# Altium schematic sheet poweramp.SchDoc
size A4
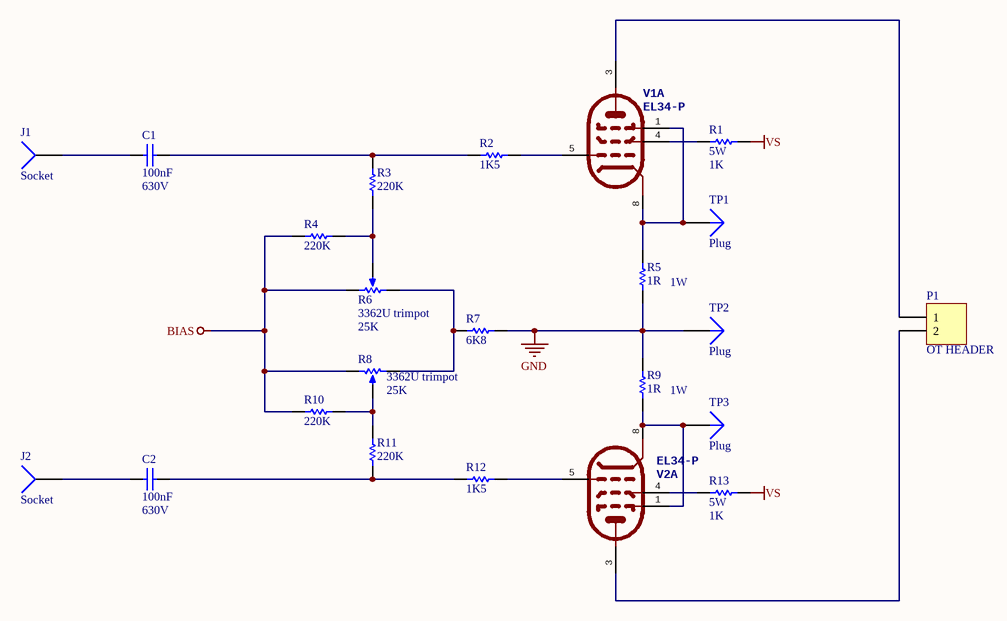
[diagram p0: poweramp.SchDoc]

## Parts
C1  value 100nF  Voltage: 630V  [ORANGE-DROP-100nF-600V]  (hidden comment: Orange Drop Capacitor)
C2  value 100nF  Voltage: 630V  [ORANGE-DROP-100nF-600V]  (hidden comment: Orange Drop Capacitor)
J1  Socket  [PIN1]
J2  Socket  [PIN1]
P1  OT HEADER  [HDR2_pin]
R1  value 1K  Power: 5W  [Resistor Vishay 5W 1k Power Wirewound]  (hidden comment: Wire Wound Power Resistor)
R2  value 1K5  [AXIAL-0.6]  (hidden comment: Metal Film Resistor 1/2W)
R3  value 220K  [AXIAL-0.6]  (hidden comment: Metal Film Resistor 1/2W)
R4  value 220K  [AXIAL-0.6]  (hidden comment: Metal Film Resistor 1/2W)
R5  value 1R  Power: 1W  [AXIAL-0.6]  (hidden comment: Metal Film Resistor 1/2W)
R6  3362U trimpot  value 25K  [33262U trimpot]
R7  value 6K8  [AXIAL-0.6]  (hidden comment: Metal Film Resistor 1/2W)
R8  3362U trimpot  value 25K  [33262U trimpot]
R9  value 1R  Power: 1W  [AXIAL-0.6]  (hidden comment: Metal Film Resistor 1/2W)
R10  value 220K  [AXIAL-0.6]  (hidden comment: Metal Film Resistor 1/2W)
R11  value 220K  [AXIAL-0.6]  (hidden comment: Metal Film Resistor 1/2W)
R12  value 1K5  [AXIAL-0.6]  (hidden comment: Metal Film Resistor 1/2W)
R13  value 1K  Power: 5W  [Resistor Vishay 5W 1k Power Wirewound]  (hidden comment: Wire Wound Power Resistor)
TP1  Plug  [PIN1]
TP2  Plug  [PIN1]
TP3  Plug  [PIN1]
V1  EL34-P  [OKTAL]  (part A of 2)
V2  EL34-P  [OKTAL]  (part A of 2)

## Nets
BIAS: R4.1 R6.2(BOT) R8.2(BOT) R10.1
GND: R5.1 R7.2 R9.2 TP2.1
VS: R1.2 R13.2
NetC1_1: C1.1 J1.1
NetC1_2: C1.2 R2.1 R3.1
NetC2_1: C2.1 J2.1
NetC2_2: C2.2 R11.2 R12.1
NetP1_1: P1.1 V1.3(PA)
NetP1_2: P1.2 V2.3(PA)
NetR1_1: R1.1 V1.4(PSG)
NetR2_2: R2.2 V1.5(PG)
NetR3_2: R3.2 R4.2 R6.3(TAP)
NetR5_2: R5.2 TP1.1 V1.1(PBG) V1.8(PK)
NetR6_1: R6.1(TOP) R7.1 R8.1(TOP)
NetR8_3: R8.3(TAP) R10.2 R11.1
NetR9_1: R9.1 TP3.1 V2.1(PBG) V2.8(PK)
NetR12_2: R12.2 V2.5(PG)
NetR13_1: R13.1 V2.4(PSG)

## Library data of the parts
C1 C2 = Cap-Orange-DROP_600V: Capacitor; Published: 8-Jun-2000; LatestRevisionDate: 17-Jul-2002; LatestRevisionNote: Re-released for DXP Platform.; PackageReference: RAD-0.3; Publisher: Altium Limited; PackageDescription: Radial Cap, Thru-Hole; 2 Leads; 0.3 in Pin Spacing
P1 = Header 2: Header, 2-Pin; LatestRevisionDate: 17-Jul-2002; LatestRevisionNote: Re-released for DXP Platform.; Publisher: Altium Limited
R1 R13 = Res Wire Wound Power Resistor 5W: Semiconductor Resistor; Published: 8-Jun-2014; LatestRevisionDate: 17-Jul-2002; LatestRevisionNote: 12-Fev-2014; PackageReference: AXIAL-1.0; Publisher: Whitesheep Amps; PackageDescription: Axial Device, Thru-Hole; 2 Leads; 0.5 in Pin Spacing
R2-R5 R7 R9-R12 = Res Metal Film 1/2W: Semiconductor Resistor; Published: 8-Jun-2000; LatestRevisionDate: 17-Jul-2002; LatestRevisionNote: 12-Fev-2014; PackageReference: AXIAL-0.6; Publisher: Whitesheep Amps; PackageDescription: Axial Device, Thru-Hole; 2 Leads; 0.5 in Pin Spacing
  R2-R4 R7 R10-R12: Power: 1/2W
R6 R8 = 3362U trimpot: 3362U Timpot; Sim Note: Enter the Resistance value and the set point into parameter fields.; Set Position: 0.5; Published: 01-Apr-2014; LatestRevisionDate: 01-Apr-2014; LatestRevisionNote: Re-released for DXP Platform.; PackageReference: 3362; Publisher: Linda Hand Build Amplification; PackageDescription: Variable Trimpot Resistor, Thru-Hole; 3 Leads
J1 J2 = Socket: LatestRevisionDate: 17-Jul-2002; LatestRevisionNote: Re-released for DXP Platform.; Publisher: Altium Limited
TP1-TP3 = Plug: LatestRevisionDate: 17-Jul-2002; LatestRevisionNote: Re-released for DXP Platform.; Publisher: Altium Limited